# EAGLE schematic MakePython ESP8266 and ESP32 (EAGLE 6.1)
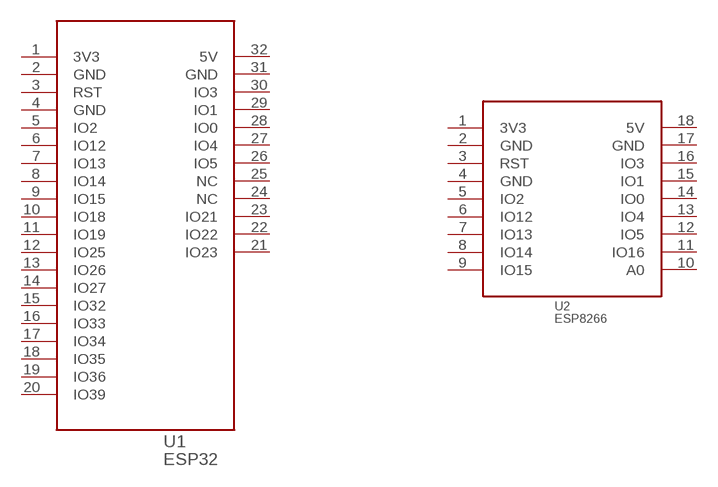
[diagram p0: schematic, sheet 1]

## Parts
U1  ESP32  [ESP32]
U2  ESP8266  [ESP8266]
Unconnected: U1.1(3V3) U1.2(GND) U1.3(RST) U1.4(GND) U1.5(IO2) U1.6(IO12) U1.7(IO13) U1.8(IO14) U1.9(IO15) U1.10(IO18) U1.11(IO19) U1.12(IO25) U1.13(IO26) U1.14(IO27) U1.15(IO32) U1.16(IO33) U1.17(IO34) U1.18(IO35) U1.19(IO36) U1.20(IO39) U1.21(IO23) U1.22(IO22) U1.23(IO21) U1.24(NC) U1.25(NC) U1.26(IO5) U1.27(IO4) U1.28(IO0) U1.29(IO1) U1.30(IO3) U1.31(GND) U1.32(5V) U2.1(3V3) U2.2(GND) U2.3(RST) U2.4(GND) U2.5(IO2) U2.6(IO12) U2.7(IO13) U2.8(IO14) U2.9(IO15) U2.10(A0) U2.11(IO16) U2.12(IO5) U2.13(IO4) U2.14(IO0) U2.15(IO1) U2.16(IO3) U2.17(GND) U2.18(5V)

## Library data of the parts
U1 = make python:ESP32
U2 = make python:ESP8266